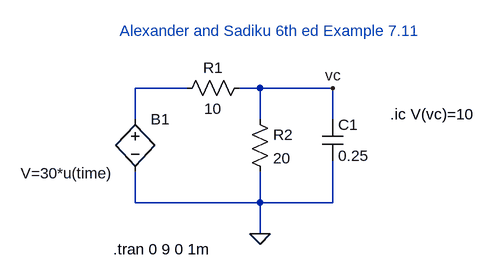
[diagram p0: schematic sadiku_chapter7_example_711_RC_Step_Response.asc]
sadiku_chapter7_example_711_RC_Step_Response.asc, the LTspice schematic file:
Version 4
SHEET 1 880 680
WIRE -64 160 -144 160
WIRE 48 160 16 160
WIRE 160 160 48 160
WIRE -144 208 -144 160
WIRE 48 208 48 160
WIRE 160 208 160 160
WIRE -144 336 -144 288
WIRE 48 336 48 288
WIRE 48 336 -144 336
WIRE 160 336 160 272
WIRE 160 336 48 336
WIRE 48 384 48 336
FLAG 48 384 0
FLAG 160 160 vc
SYMBOL res 32 144 R90
WINDOW 0 0 56 VBottom 2
WINDOW 3 32 56 VTop 2
SYMATTR InstName R1
SYMATTR Value 10
SYMBOL res 32 192 R0
SYMATTR InstName R2
SYMATTR Value 20
SYMBOL cap 144 208 R0
SYMATTR InstName C1
SYMATTR Value 0.25
SYMBOL bv -144 192 R0
WINDOW 3 -176 99 Left 2
SYMATTR InstName B1
SYMATTR Value V=30*u(time)
TEXT 248 200 Left 2 !.ic V(vc)=10
TEXT -178 408 Left 2 !.tran 0 9 0 1m
TEXT -168 72 Left 2 ;Alexander and Sadiku 6th ed Example 7.11

The netlist it stands for:
* sadiku_chapter7_example_711_RC_Step_Response.asc
R1 vc N001 10
R2 vc 0 20
C1 vc 0 0.25
B1 N001 0 V=30*u(time)
.ic V(vc)=10
.tran 0 9 0 1m
* Alexander and Sadiku 6th ed Example 7.11
.backanno
.end

* Results of the author's LTspice run, read from the files saved beside the schematic
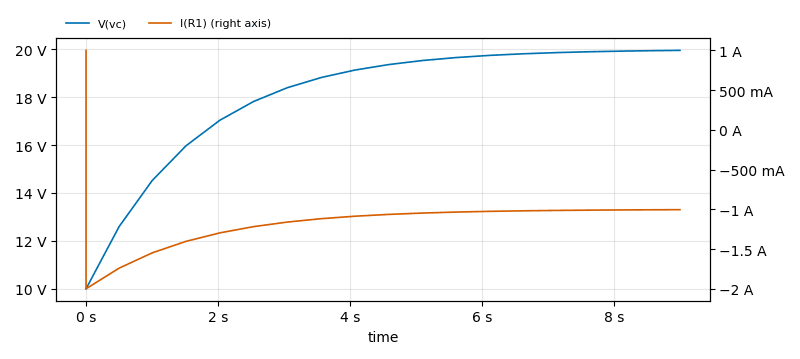
[diagram p1: Transient Analysis of sadiku_chapter7_example_711_RC_Step_Response.asc, plotted from the saved traces]
* Transient Analysis, 1 run:
*   V(vc): min 10 V, max 19.95 V, average 18.14 V, rms 18.31 V, last 19.95 V
*   I(R1): min -2 A, max 1 A, average -1.186 A, rms 1.211 A, last -1.005 A